# Altium schematic sheet LED_Wall [Microcontroller].SchDoc: MICROCONTROLLER
size Letter
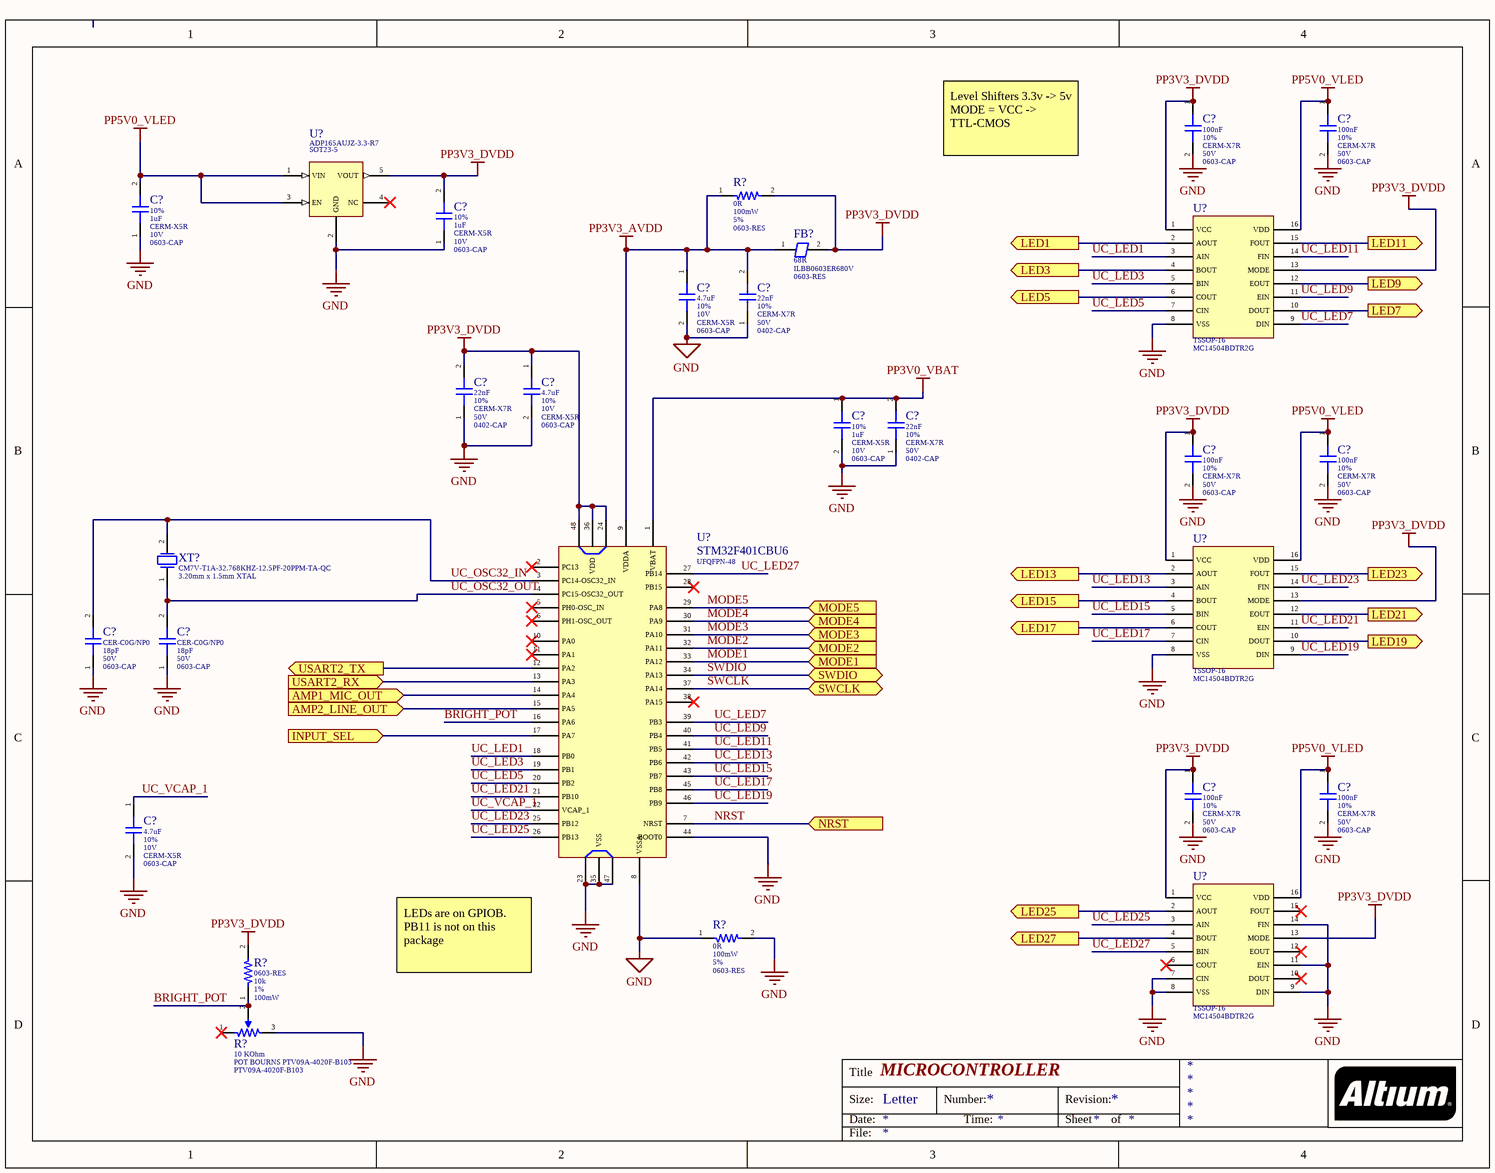
[diagram p0: LED_Wall [Microcontroller].SchDoc]

## Parts
(Parts that share a designator on the sheet are numbered #1, #2 ... from top to bottom, then left to right.)
C?#1  Capacitance: 100nF  Tolerance: 10%  Dielectric: CERM-X7R  Voltage: 50V  [0603-CAP]  (hidden comment: CAP TDK CGA3E2X7R1H104K080AA)
C?#2  Capacitance: 100nF  Tolerance: 10%  Dielectric: CERM-X7R  Voltage: 50V  [0603-CAP]  (hidden comment: CAP TDK CGA3E2X7R1H104K080AA)
C?#3  Tolerance: 10%  Capacitance: 1uF  Dielectric: CERM-X5R  Voltage: 10V  [0603-CAP]
C?#4  Tolerance: 10%  Capacitance: 1uF  Dielectric: CERM-X5R  Voltage: 10V  [0603-CAP]
C?#5  Capacitance: 4.7uF  Tolerance: 10%  Voltage Rating: 10V  Dielectric: CERM-X5R  [0603-CAP]  (hidden comment: CAP SAMSUNG CL10A475KP8NNNC)
C?#6  Capacitance: 22nF  Tolerance: 10%  Dielectric: CERM-X7R  Voltage: 50V  [0402-CAP]
C?#7  Capacitance: 22nF  Tolerance: 10%  Dielectric: CERM-X7R  Voltage: 50V  [0402-CAP]
C?#8  Capacitance: 4.7uF  Tolerance: 10%  Voltage Rating: 10V  Dielectric: CERM-X5R  [0603-CAP]  (hidden comment: CAP SAMSUNG CL10A475KP8NNNC)
C?#9  Tolerance: 10%  Capacitance: 1uF  Dielectric: CERM-X5R  Voltage: 10V  [0603-CAP]
C?#10  Capacitance: 22nF  Tolerance: 10%  Dielectric: CERM-X7R  Voltage: 50V  [0402-CAP]
C?#11  Capacitance: 100nF  Tolerance: 10%  Dielectric: CERM-X7R  Voltage: 50V  [0603-CAP]  (hidden comment: CAP TDK CGA3E2X7R1H104K080AA)
C?#12  Capacitance: 100nF  Tolerance: 10%  Dielectric: CERM-X7R  Voltage: 50V  [0603-CAP]  (hidden comment: CAP TDK CGA3E2X7R1H104K080AA)
C?#13  Dielectric: CER-C0G/NP0  Capacitance: 18pF  Voltage - Rated: 50V  [0603-CAP]
C?#14  Dielectric: CER-C0G/NP0  Capacitance: 18pF  Voltage - Rated: 50V  [0603-CAP]
C?#15  Capacitance: 100nF  Tolerance: 10%  Dielectric: CERM-X7R  Voltage: 50V  [0603-CAP]  (hidden comment: CAP TDK CGA3E2X7R1H104K080AA)
C?#16  Capacitance: 100nF  Tolerance: 10%  Dielectric: CERM-X7R  Voltage: 50V  [0603-CAP]  (hidden comment: CAP TDK CGA3E2X7R1H104K080AA)
C?#17  Capacitance: 4.7uF  Tolerance: 10%  Voltage Rating: 10V  Dielectric: CERM-X5R  [0603-CAP]  (hidden comment: CAP SAMSUNG CL10A475KP8NNNC)
FB?  Impedance: 68R  Manufacturer Part Number: ILBB0603ER680V  [0603-RES]  (hidden comment: FB VISHAY ILBB0603ER680V)
R?#1  Resistance: 0R  Power Rating: 100mW  Resistance Tolerance: 5%  [0603-RES]  (hidden comment: RES YAGEO RC0603JR-070RL)
R?#2  Resistance: 0R  Power Rating: 100mW  Resistance Tolerance: 5%  [0603-RES]  (hidden comment: RES YAGEO RC0603JR-070RL)
R?#3  Resistance: 10k  Tolerance: 1%  Power: 100mW  [0603-RES]  (hidden comment: RES BOURNS CR0603AFX-1002EAS)
R?#4  Resistance Value: 10 KOhm  Manufacturer Part Number: PTV09A-4020F-B103  [POT BOURNS PTV09A-4020F-B103]  (hidden comment: POT BOURNS PTV09A-4020F-B103)
U?#1  Manufacturer Part Number: ADP165AUJZ-3.3-R7  [SOT23-5]  (hidden comment: IC ANALOG DEVICES ADP165AUJZ-3.3-R7)
U?#2  Manufacturer Part Number: MC14504BDTR2G  [TSSOP-16]  (hidden comment: IC ON MC14504BDTR2G)
U?#3  Manufacturer Part Number: MC14504BDTR2G  [TSSOP-16]  (hidden comment: IC ON MC14504BDTR2G)
U?#4  Manufacturer Part Number: STM32F401CBU6  [UFQFPN-48]  (hidden comment: *)
U?#5  Manufacturer Part Number: MC14504BDTR2G  [TSSOP-16]  (hidden comment: IC ON MC14504BDTR2G)
XT?  Manufacturer Part Number: CM7V-T1A-32.768KHZ-12.5PF-20PPM-TA-QC  [3.20mm x 1.5mm XTAL]  (hidden comment: *)

## Ports
AMP1_MIC_OUT (in), AMP2_LINE_OUT (in), INPUT_SEL (in), LED1 (out), LED3 (out), LED5 (out), LED7 (out), LED9 (out), LED11 (out), LED13 (out), LED15 (out), LED17 (out), LED19 (out), LED21 (out), LED23 (out), LED25 (out), LED27 (out), MODE1 (in), MODE2 (in), MODE3 (in), MODE4 (in), MODE5 (in), NRST (in), SWCLK (bidir), SWDIO (bidir), USART2_RX (in), USART2_TX (out)

## Nets
GND: C?#1.2 C?#2.2 C?#3.1 C?#4.1 C?#5.2 C?#6.1 C?#7.1 C?#8.2 C?#9.2 C?#10.1 C?#11.2 C?#12.2 C?#13.1 C?#14.1 C?#15.2 C?#16.2 C?#17.2 R?#2.1 R?#2.2 R?#4.3 U?#1.2(GND) U?#2.8(VSS) U?#3.8(VSS) U?#4.8(VSSA) U?#4.23(VSS) U?#4.35(VSS) U?#4.44(BOOT0) U?#4.47(VSS) U?#5.7(CIN) U?#5.8(VSS) U?#5.9(DIN) U?#5.11(EIN) U?#5.14(FIN)
PP3V0_VBAT: C?#9.1 C?#10.2 U?#4.1(VBAT)
PP3V3_AVDD: C?#5.1 C?#6.2 FB?.1 R?#1.1 U?#4.9(VDDA)
PP3V3_DVDD: C?#1.1 C?#4.2 C?#7.2 C?#8.1 C?#11.1 C?#15.1 FB?.2 R?#1.2 R?#3.2 U?#1.5(VOUT) U?#2.1(VCC) U?#2.13(MODE) U?#3.1(VCC) U?#3.13(MODE) U?#4.24(VDD) U?#4.36(VDD) U?#4.48(VDD) U?#5.1(VCC) U?#5.13(MODE)
PP5V0_VLED: C?#2.1 C?#3.2 C?#12.1 C?#16.1 U?#1.1(VIN) U?#1.3(EN) U?#2.16(VDD) U?#3.16(VDD) U?#5.16(VDD)
AMP1_MIC_OUT: U?#4.14(PA4) ; port AMP1_MIC_OUT
AMP2_LINE_OUT: U?#4.15(PA5) ; port AMP2_LINE_OUT
BRIGHT_POT: R?#3.1 R?#4.2 U?#4.16(PA6)
INPUT_SEL: U?#4.17(PA7) ; port INPUT_SEL
LED1: U?#2.2(AOUT) ; port LED1
LED3: U?#2.4(BOUT) ; port LED3
LED5: U?#2.6(COUT) ; port LED5
LED7: U?#2.10(DOUT) ; port LED7
LED9: U?#2.12(EOUT) ; port LED9
LED11: U?#2.15(FOUT) ; port LED11
LED13: U?#3.2(AOUT) ; port LED13
LED15: U?#3.4(BOUT) ; port LED15
LED17: U?#3.6(COUT) ; port LED17
LED19: U?#3.10(DOUT) ; port LED19
LED21: U?#3.12(EOUT) ; port LED21
LED23: U?#3.15(FOUT) ; port LED23
LED25: U?#5.2(AOUT) ; port LED25
LED27: U?#5.4(BOUT) ; port LED27
MODE1: U?#4.33(PA12) ; port MODE1
MODE2: U?#4.32(PA11) ; port MODE2
MODE3: U?#4.31(PA10) ; port MODE3
MODE4: U?#4.30(PA9) ; port MODE4
MODE5: U?#4.29(PA8) ; port MODE5
NRST: U?#4.7(NRST) ; port NRST
SWCLK: U?#4.37(PA14) ; port SWCLK
SWDIO: U?#4.34(PA13) ; port SWDIO
UC_LED1: U?#2.3(AIN) U?#4.18(PB0)
UC_LED3: U?#2.5(BIN) U?#4.19(PB1)
UC_LED5: U?#2.7(CIN) U?#4.20(PB2)
UC_LED7: U?#2.9(DIN) U?#4.39(PB3)
UC_LED9: U?#2.11(EIN) U?#4.40(PB4)
UC_LED11: U?#2.14(FIN) U?#4.41(PB5)
UC_LED13: U?#3.3(AIN) U?#4.42(PB6)
UC_LED15: U?#3.5(BIN) U?#4.43(PB7)
UC_LED17: U?#3.7(CIN) U?#4.45(PB8)
UC_LED19: U?#3.9(DIN) U?#4.46(PB9)
UC_LED21: U?#3.11(EIN) U?#4.21(PB10)
UC_LED23: U?#3.14(FIN) U?#4.25(PB12)
UC_LED25: U?#4.26(PB13) U?#5.3(AIN)
UC_LED27: U?#4.27(PB14) U?#5.5(BIN)
UC_OSC32_IN: C?#13.2 U?#4.3(PC14-OSC32_IN) XT?.2
UC_OSC32_OUT: C?#14.2 U?#4.4(PC15-OSC32_OUT) XT?.1
UC_VCAP_1: C?#17.1 U?#4.22(VCAP_1)
USART2_RX: U?#4.13(PA3) ; port USART2_RX
USART2_TX: U?#4.12(PA2) ; port USART2_TX

Not connected (* = marked no-connect by the designer): R?#4 1*; U?#1 4(NC)*; U?#4 2(PC13)* 5(PH0-OSC_IN)* 6(PH1-OSC_OUT)* 10(PA0)* 11(PA1)* 28(PB15)* 38(PA15)*; U?#5 6(COUT)* 10(DOUT)* 12(EOUT)* 15(FOUT)*

## Notes on the sheet
- Level Shifters 3.3v -> 5v
  MODE = VCC -> TTL-CMOS
- (near U?#4) LEDs are on GPIOB.
  PB11 is not on this package
- Title
- Size:
- Date:
- Letter
- Number:
- Time:
- Revision:
- Sheet
- of
- File:

## Library data of the parts
C?#1 C?#2 C?#11 C?#12 C?#15 C?#16 = CAP TDK CGA3E2X7R1H104K080AA: CAP CER 0.1UF 50V X7R 0603; Supplier 1: Digi-Key; Manufacturer: TDK; Manufacturer Part Number: CGA3E2X7R1H104K080AA; Stock 1: 11391991; Pricing 1: 1=0.1, 10=0.075, 100=0.0335, 500=0.0239, 1000=0.0188 (USD); Mount: Surface Mount; Case/Package: 0603; Weight: 7.1E-05oz; Case Code (Imperial): 0603; Case Code (Metric): 1608; Min Operating Temperature: -55°C; Max Operating Temperature: 125°C; Voltage Rating (DC): 50V; Packaging: Tape and Reel; Package Quantity: 1; Voltage Rating: 50V; Termination: SMD/SMT; Composition: Ceramic; Length: 1.6mm; Height: 0.8mm; Width: 0.8mm; Thickness: 0.035inch; Depth: 0.8mm; Ratings: AEC-Q200; Radiation Hardening: No; REACH SVHC: No SVHC; Lead Free: Lead Free; ComponentLink1URL: http://www.farnell.com/datasheets/1796654.pdf?src-supplier=Mouser; ComponentLink1Description: http://www.farnell.com/datasheets/1796654.pdf?src-supplier=Mouser; ComponentLink2URL: http://product.tdk.com/capacitor/mlcc/en/documents/mlccspec_automotive_general_midvoltage_en.pdf?src-supplier=Future+Electronics; ComponentLink2Description: http://product.tdk.com/capacitor/mlcc/en/documents/mlccspec_automotive_general_midvoltage_en.pdf?src-supplier=Future+Electronics; ComponentLink3URL: http://www.farnell.com/datasheets/1735392.pdf?src-supplier=Element14; ComponentLink3Description: http://www.farnell.com/datasheets/1735392.pdf?src-supplier=Element14; ComponentLink4URL: https://www.verical.com/server-webapp/html/getDatasheet?partID=715867&src-supplier=Verical; ComponentLink4Description: https://www.verical.com/server-webapp/html/getDatasheet?partID=715867&src-supplier=Verical; ComponentLink5URL: http://www.farnell.com/datasheets/1796654.pdf?src-supplier=Newark; ComponentLink5Description: http://www.farnell.com/datasheets/1796654.pdf?src-supplier=Newark; Supplier Part Number 1: 445-5666-1-ND; CurrentFootprint: 0603-CAP
C?#3 C?#4 C?#9 = CAP SAMSUNG CL10A105KP8NNNC: CAP CER 1UF 10V X5R 0603; Supplier 1: Digi-Key; Manufacturer: Samsung; Manufacturer Part Number: CL10A105KP8NNNC; Stock 1: 4040315; Pricing 1: 1=0.1, 10=0.036, 100=0.0161, 500=0.0115, 1000=0.0091 (USD); Mount: Surface Mount; Case/Package: 0603; Case Code (Metric): 1608; Case Code (Imperial): 0603; Contact Plating: Tin; Min Operating Temperature: -55°C; Max Operating Temperature: 85°C; Packaging: Tape and Reel; Package Quantity: 1; Voltage Rating: 10V; Length: 1.6mm; Height: 0.8mm; Width: 0.031inch; Thickness: 0.035inch; Depth: 0.8mm; Radiation Hardening: No; ComponentLink1URL: https://www.verical.com/server-webapp/html/getDatasheet?partID=358616&src-supplier=Verical; ComponentLink1Description: https://www.verical.com/server-webapp/html/getDatasheet?partID=358616&src-supplier=Verical; ComponentLink2URL: http://www1.futureelectronics.com/doc/SAMSUNG%20PASSIVE/CL05B104KQ5NNNC.pdf?src-supplier=Future+Electronics; ComponentLink2Description: http://www1.futureelectronics.com/doc/SAMSUNG%20PASSIVE/CL05B104KQ5NNNC.pdf?src-supplier=Future+Electronics; Supplier Part Number 1: 1276-1182-1-ND; CurrentFootprint: 0603-CAP
C?#5 C?#8 C?#17 = CAP SAMSUNG CL10A475KP8NNNC: CAP CER 4.7UF 10V X5R 0603; Supplier 1: Digi-Key; Manufacturer: Samsung; Manufacturer Part Number: CL10A475KP8NNNC; Stock 1: 2594398; Pricing 1: 1=0.13, 10=0.096, 100=0.0452, 500=0.0317, 1000=0.0262 (USD); Mount: Surface Mount; Case/Package: 0603; Case Code (Metric): 1608; Case Code (Imperial): 0603; Contact Plating: Tin; Min Operating Temperature: -55°C; Max Operating Temperature: 85°C; Package Quantity: 1; Packaging: Tape and Reel; Length: 1.6mm; Height: 0.8mm; Width: 0.031inch; Thickness: 0.035inch; Depth: 0.8mm; Radiation Hardening: No; ComponentLink1URL: http://www.samsungsem.com/kr/support/library/product-catalog/mlcc.jsp?src-supplier=Digi-Key; ComponentLink1Description: http://www.samsungsem.com/kr/support/library/product-catalog/mlcc.jsp?src-supplier=Digi-Key; ComponentLink2URL: https://www.verical.com/server-webapp/html/getDatasheet?partID=358676&src-supplier=Verical; ComponentLink2Description: https://www.verical.com/server-webapp/html/getDatasheet?partID=358676&src-supplier=Verical; ComponentLink3URL: http://www1.futureelectronics.com/doc/SAMSUNG%20PASSIVE/CL05B104KQ5NNNC.pdf?src-supplier=Future+Electronics; ComponentLink3Description: http://www1.futureelectronics.com/doc/SAMSUNG%20PASSIVE/CL05B104KQ5NNNC.pdf?src-supplier=Future+Electronics; Supplier Part Number 1: 1276-1044-1-ND; CurrentFootprint: 0603-CAP
C?#6 C?#7 C?#10 = CAP MURATA GRM155R71H223KA12D: CAP CER 0.022UF 50V X7R 0402; Manufacturer: Murata; Material: Ceramic; Supplier 1: Digi-Key; Manufacturer Part Number: GRM155R71H223KA12D; Stock 1: 502642; Pricing 1: 1=0.1, 10=0.053, 100=0.0237, 500=0.0169, 1000=0.0133, 2500=0.0121, 5000=0.0111 (USD); Mount: Surface Mount; Case/Package: 0402; Number of Pins: 2; Case Code (Metric): 1005; Case Code (Imperial): 0402; Min Operating Temperature: -55°C; Max Operating Temperature: 125°C; Packaging: Tape and Reel; Package Quantity: 1; Voltage Rating: 50V; Voltage Rating (DC): 50V; Termination: SMD/SMT; Length: 1mm; Height: 0.5mm; Width: 0.02inch; Thickness: 0.022inch; Depth: 0.5mm; Radiation Hardening: No; REACH SVHC: No SVHC; Lead Free: Lead Free; ComponentLink1URL: https://www.verical.com/server-webapp/html/getDatasheet?partID=178940&src-supplier=Verical; ComponentLink1Description: https://www.verical.com/server-webapp/html/getDatasheet?partID=178940&src-supplier=Verical; ComponentLink2URL: https://www.murata.com/~/media/webrenewal/support/library/catalog/products/capacitor/mlcc/c02e.ashx?la=en-us&src-supplier=Digi-Key; ComponentLink2Description: https://www.murata.com/~/media/webrenewal/support/library/catalog/products/capacitor/mlcc/c02e.ashx?la=en-us&src-supplier=Digi-Key; ComponentLink3URL: http://www.farnell.com/datasheets/2048677.pdf?src-supplier=Element14; ComponentLink3Description: http://www.farnell.com/datasheets/2048677.pdf?src-supplier=Element14; ComponentLink4URL: http://search.murata.co.jp/Ceramy/image/img/w_hinm/L0005E.pdf?src-supplier=Future+Electronics; ComponentLink4Description: http://search.murata.co.jp/Ceramy/image/img/w_hinm/L0005E.pdf?src-supplier=Future+Electronics; ComponentLink5URL: https://produktinfo.conrad.com/datenblaetter/450000-474999/454297-da-01-en-VS_KONDENSATOR_0402.pdf?src-supplier=Conrad; ComponentLink5Description: https://produktinfo.conrad.com/datenblaetter/450000-474999/454297-da-01-en-VS_KONDENSATOR_0402.pdf?src-supplier=Conrad; Supplier Part Number 1: 490-3884-1-ND; CurrentFootprint: 0402-CAP
C?#13 C?#14 = CAP YAGEO CC0603JRNPO9BN180: CAP CER 18PF 50V C0G/NPO 0603; Manufacturer: Yageo; Product Training Modules: Multilayer Ceramic Capacitors; Featured Product: Commodity Multilayer Ceramic Capacitors – CC Series; Temperature Coefficient: C0G, NP0; Online Catalog: CC Series; Other Names: 311-1061-6 311-1279-6 311-1279-6-ND; Tolerance: ±5%; Supplier 1: Digi-Key; Supplier Part Number 1: 311-1061-1-ND; Stock 1: 146690; Pricing 1: 1=0.1, 10=0.047, 100=0.0208, 500=0.0149, 1000=0.0117 (USD); Standard Package: 1; Category: Capacitors; Family: Ceramic Capacitors; Series: CC; Packaging: Digi-Reel®; Mounting Type: Surface Mount, MLCC; Operating Temperature: -55°C ~ 125°C; Applications: General Purpose; Ratings: -; Package / Case: 0603 (1608 Metric); Size / Dimension: 0.063" L x 0.031" W (1.60mm x 0.80mm); Height - Seated (Max): -; Thickness (Max): 0.035" (0.90mm); Lead Spacing: -; Features: -; Lead Style: -; ComponentLink1URL: http://www.farnell.com/datasheets/1734582.pdf?src-supplier=Element14; ComponentLink1Description: http://www.farnell.com/datasheets/1734582.pdf?src-supplier=Element14; ComponentLink2URL: http://www.farnell.com/datasheets/2213336.pdf?src-supplier=Element14; ComponentLink2Description: http://www.farnell.com/datasheets/2213336.pdf?src-supplier=Element14; ComponentLink3URL: http://www.yageo.com/documents/recent/UPY-GP_NP0_16V-to-50V_8.pdf?src-supplier=Avnet; ComponentLink3Description: http://www.yageo.com/documents/recent/UPY-GP_NP0_16V-to-50V_8.pdf?src-supplier=Avnet; ComponentLink4URL: http://www.yageo.com/documents/recent/UPY-GP_NP0_16V-to-50V_16.pdf?src-supplier=Digi-Key; ComponentLink4Description: http://www.yageo.com/documents/recent/UPY-GP_NP0_16V-to-50V_16.pdf?src-supplier=Digi-Key; ComponentLink5URL: http://www.yageo.com/documents/recent/UPY-GP_NP0_16V-to-50V_8.pdf?src-supplier=Avnet+Europe; ComponentLink5Description: http://www.yageo.com/documents/recent/UPY-GP_NP0_16V-to-50V_8.pdf?src-supplier=Avnet+Europe; ComponentLink6URL: http://www.farnell.com/datasheets/1443161.pdf?src-supplier=Element14; ComponentLink6Description: http://www.farnell.com/datasheets/1443161.pdf?src-supplier=Element14; ComponentLink7URL: http://www.mouser.com/ds/2/447/Yageo_UPY-GP_NP0_16V-to-50V_9-358835.pdf?src-supplier=Mouser; ComponentLink7Description: http://www.mouser.com/ds/2/447/Yageo_UPY-GP_NP0_16V-to-50V_9-358835.pdf?src-supplier=Mouser; Manufacturer Part Number: CC0603JRNPO9BN180; CurrentFOotprint: 0603-CAP
FB? = FB VISHAY ILBB0603ER680V: FERRITE BEAD 68 OHM 0603 1LN; Current Rating: 200mA; Tolerance: 25%; Number of Lines: 1; DC Resistance (DCR): 100mR; Test Frequency: 100MHz; Inductance: 68uH; Supplier 1: Digi-Key; Manufacturer: Vishay; Stock 1: 4606; Pricing 1: 1=0.1, 10=0.073, 25=0.066, 50=0.0594, 100=0.0436, 250=0.0317, 500=0.029, 1000=0.0251 (USD); Mount: Surface Mount; Case/Package: 0603; Number of Pins: 2; Weight: 7.1E-05oz; Core Material: Ferrite; Case Code (Metric): 1608; Case Code (Imperial): 0603; Min Operating Temperature: -55°C; Max Operating Temperature: 125°C; Packaging: Tape and Reel; Package Quantity: 4000; Max Current Rating: 200mA; Termination: SMD/SMT; Max DC Current: 200mA; Length: 0.063inch; Height: 0.037inch; Width: 0.031inch; Depth: 0.95mm; Lead Free: Lead Free; ComponentLink1URL: http://components.arrow.com/part/dataview/41529776S9710326N6892?src-supplier=Arrow; ComponentLink1Description: http://components.arrow.com/part/dataview/41529776S9710326N6892?src-supplier=Arrow; ComponentLink2URL: http://www.vishay.com/docs/34024/ilbb0603.pdf?src-supplier=Digi-Key; ComponentLink2Description: http://www.vishay.com/docs/34024/ilbb0603.pdf?src-supplier=Digi-Key; Supplier Part Number 1: 541-2605-1-ND; Current Footprint: 0603-RES
R?#1 R?#2 = RES YAGEO RC0603JR-070RL: RES SMD 0 OHM JUMPER 1/10W 0603; Voltage Rating: 50V; Resistor Case Style: 0603 [1608 Metric]; Product Range: RC Series; Resistor Element Type: Thick Film; Temperature Coefficient: ± 200ppm/°C; SVHC: To Be Advised; Supplier 1: Digi-Key; Supplier Part Number 1: 311-0.0GRDKR-ND; Manufacturer: Yageo; Stock 1: 20967340; Pricing 1: 1=0.1, 10=0.019, 25=0.0136, 50=0.0104, 100=0.0077, 250=0.0059, 500=0.0047, 1000=0.0035 (USD); Packaging: Cut Tape; Automotive Qualification Standard: -; MSL: MSL 1 - Unlimited; ComponentLink1URL: http://www.farnell.com/datasheets/2167052.pdf?src-supplier=Element14; ComponentLink1Description: http://www.farnell.com/datasheets/2167052.pdf?src-supplier=Element14; ComponentLink2URL: https://www.verical.com/server-webapp/html/getDatasheet?partID=329462&src-supplier=Verical; ComponentLink2Description: https://www.verical.com/server-webapp/html/getDatasheet?partID=329462&src-supplier=Verical; ComponentLink3URL: http://www.yageo.com/documents/recent/PYu-RC_Group_51_RoHS_L_9.pdf?src-supplier=Mouser; ComponentLink3Description: http://www.yageo.com/documents/recent/PYu-RC_Group_51_RoHS_L_9.pdf?src-supplier=Mouser; ComponentLink4URL: http://www.farnell.com/datasheets/443971.pdf?src-supplier=Element14; ComponentLink4Description: http://www.farnell.com/datasheets/443971.pdf?src-supplier=Element14; ComponentLink5URL: http://documents.rs-components.com/techlib://itc_doclist_GB.htm?stockno=6515918&src-supplier=RSComponents; ComponentLink5Description: http://documents.rs-components.com/techlib://itc_doclist_GB.htm?stockno=6515918&src-supplier=RSComponents; Manufacturer Part Number: RC0603JR-070RL; CurrentFootprint: 0603-RES
R?#3 = RES BOURNS CR0603AFX-1002EAS: RESA-AS 0603 10K 1% 100MW TC100; Supplier 1: Digi-Key; Manufacturer: Bourns; Manufacturer Part Number: CR0603AFX-1002EAS; Stock 1: 4756; Pricing 1: 1=0.1, 10=0.075, 100=0.0307, 1000=0.0138, 2500=0.012 (USD); Supplier Part Number 1: CR0603AFX-1002EASCT-ND; Current Footprint: 0603-RES
R?#4 = POT BOURNS PTV09A-4020F-B103: POT 10K OHM 1/20W CARBON LINEAR; Number of Turns: 1(Elec)|1(Mech) Turns; Rad Hard: No; Shaft Diameter: 6 mm; Supplier 1: Digi-Key; Supplier Part Number 1: PTV09A-4020F-B103-ND; Manufacturer: Bourns; Stock 1: 626; Pricing 1: 1=0.83, 10=0.744, 25=0.672, 50=0.648, 100=0.612, 250=0.588, 500=0.552, 1000=0.456, 5000=0.372 (USD); Packaging: Bulk; Type: Potentiometer; Mounting: Bracket Mount/Through Hole; Technology: Carbon Film; Operating Temperature: -10 to 50 °C; ComponentLink1URL: https://www.bourns.com/docs/Product-Datasheets/PTV09.pdf?src-supplier=Digi-Key; ComponentLink1Description: https://www.bourns.com/docs/Product-Datasheets/PTV09.pdf?src-supplier=Digi-Key; ComponentLink2URL: http://uk.rs-online.com/webdocs/0fa5/0900766b80fa58ec.pdf?src-supplier=RSComponents; ComponentLink2Description: http://uk.rs-online.com/webdocs/0fa5/0900766b80fa58ec.pdf?src-supplier=RSComponents; Current Footprint: POT BOURNS PTV09A-4020F-B103
U?#1 = IC ANALOG DEVICES ADP165AUJZ-3.3-R7: IC REG LIN POS ADJ 150MA TSOT23; Output Voltage: 3.3V; Dropout Voltage: 120mV; Number of Regulators: 1; Min Current Limit: 215mA; Polarity: Positive; Quiescent Current: 590nA; Max Input Voltage: 5.5V; Min Input Voltage: 2.2V; Accuracy: 1%; Output Type: Fixed; Supplier 1: Digi-Key; Manufacturer: Analog Devices; Stock 1: 2434; Pricing 1: 1=1.16, 10=1.033, 25=0.98, 100=0.805, 250=0.7525, 500=0.665, 1000=0.525 (USD); Mount: Surface Mount; Case/Package: SOT-23-5; Number of Pins: 5; Contact Plating: Gold; Min Operating Temperature: -40°C; Max Operating Temperature: 125°C; Packaging: Tape and Reel; Output Current: 150mA; Number of Outputs: 1; Max Output Current: 150mA; Lead Free: Contains Lead; ComponentLink1URL: http://www.analog.com/media/en/technical-documentation/data-sheets/ADP165_166.pdf?src-supplier=Digi-Key; ComponentLink1Description: http://www.analog.com/media/en/technical-documentation/data-sheets/ADP165_166.pdf?src-supplier=Digi-Key; ComponentLink2URL: http://www.analog.com/static/imported-files/data_sheets/ADP165_166.pdf?src-supplier=Avnet; ComponentLink2Description: http://www.analog.com/static/imported-files/data_sheets/ADP165_166.pdf?src-supplier=Avnet; ComponentLink3URL: https://www.analog.com/media/en/technical-documentation/data-sheets/ADP165_166.pdf?src-supplier=Digi-Key; ComponentLink3Description: https://www.analog.com/media/en/technical-documentation/data-sheets/ADP165_166.pdf?src-supplier=Digi-Key; Supplier Part Number 1: ADP165AUJZ-3.3-R7CT-ND; CurrentFootprint: SOT23-5
U?#2 U?#3 U?#5 = IC ON MC14504BDTR2G: IC TRNSLTR UNIDIR 16TSSOP; Manufacturer: ON Semiconductor; Translator Type: Voltage Level; Channel Type: Unidirectional; Number of Circuits: 1; Channels per Circuit: 6; Voltage - VCCA: 3 V ~ 18 V; Output Type: Non-Inverted; Supplier 1: Digi-Key; Supplier Part Number 1: MC14504BDTR2GOSCT-ND; Stock 1: 11285; Pricing 1: 1=1.24, 10=1.107, 25=1.0512, 100=0.8634, 250=0.8071, 500=0.7133, 1000=0.5631 (USD); Category: Integrated Circuits (ICs); Family: Logic - Translators, Level Shifters; Series: -; Packaging: Digi-Reel®; Voltage - VCCB: 3 V ~ 18 V; Input Signal: -; Output Signal: -; Data Rate: -; Operating Temperature: -55°C ~ 125°C (TA); Features: -; Mounting Type: Surface Mount; Package / Case: 16-TSSOP (0.173", 4.40mm Width); Supplier Device Package: 16-TSSOP; ComponentLink1URL: http://www.onsemi.com/pub/Collateral/MC14504B-D.PDF?src-supplier=Avnet; ComponentLink1Description: http://www.onsemi.com/pub/Collateral/MC14504B-D.PDF?src-supplier=Avnet; ComponentLink2URL: http://www.onsemi.com/pub_link/Collateral/MC14504B-D.PDF?src-supplier=Future+Electronics; ComponentLink2Description: http://www.onsemi.com/pub_link/Collateral/MC14504B-D.PDF?src-supplier=Future+Electronics; ComponentLink3URL: http://www.onsemi.com/pub_link/Collateral/MC14504B-D.PDF?src-supplier=Digi-Key; ComponentLink3Description: http://www.onsemi.com/pub_link/Collateral/MC14504B-D.PDF?src-supplier=Digi-Key; ComponentLink4URL: http://www.onsemi.com/pub/Collateral/MC14504B-D.PDF?src-supplier=Digi-Key; ComponentLink4Description: http://www.onsemi.com/pub/Collateral/MC14504B-D.PDF?src-supplier=Digi-Key; ComponentLink5URL: http://www.onsemi.com/pub/Collateral/MC14504B-D.PDF?src-supplier=Avnet+Europe; ComponentLink5Description: http://www.onsemi.com/pub/Collateral/MC14504B-D.PDF?src-supplier=Avnet+Europe; CurrentFootprint: TSSOP-16
U?#4 = IC ST STM32F401CBU6: IC MCU 32BIT 128KB FLASH 48QFPN; Manufacturer: STMicroelectronics; Interface: I2C,SPI,USB,IrDA,SDIO,UART,USART,LIN,I2S; Max Supply Voltage: 3.6V; Min Supply Voltage: 1.8V; Operating Supply Voltage: 3.3V; Frequency: 84MHz; RAM Size: 64KB; Max Power Dissipation: 625mW; Number of I/Os: 36; Number of Timers/Counters: 8; Oscillator Type: Internal; Data Bus Width: 32b; Number of USB Channels: 1; Number of SPI Channels: 7; Number of PWM Channels: 4; Number of I2C Channels: 3; Watchdog Timer: Yes; Peripherals: Brown-out Detect/Reset,POR,PWM,WDT,DMA; Core Architecture: ARM; Supplier 1: Digi-Key; Stock 1: 403; Pricing 1: 1=3.99, 10=3.581, 25=3.386, 100=2.9344, 250=2.7839, 500=2.498, 1000=2.1067, 2500=2.0014, 5000=1.9261 (USD); Case/Package: UFQFPN; Number of Pins: 48; Contact Plating: Tin,Matte; Min Operating Temperature: -40°C; Max Operating Temperature: 85°C; Packaging: Tray; Memory Type: FLASH; Package Quantity: 1560; Max Frequency: 84MHz; Number of Programmable I/O: 36; Memory Size: 128KB; Length: 7.1mm; Height: 0.55mm; Width: 7.1mm; Radiation Hardening: No; Lead Free: Lead Free; REACH SVHC: No SVHC; ComponentLink1URL: http://www.st.com/st-web-ui/static/active/en/resource/technical/document/datasheet/DM00086815.pdf?src-supplier=Avnet; ComponentLink1Description: http://www.st.com/st-web-ui/static/active/en/resource/technical/document/datasheet/DM00086815.pdf?src-supplier=Avnet; Supplier Part Number 1: 497-17425-ND; Current Footprint: UFQFPN-48
XT? = XTAL MICRO CM7V-T1A-32.768KHZ-12.5PF-20PPM-TA-QC: CRYSTAL 32.768KHZ 12.5PF SMD; Manufacturer: Micro Crystal; Supplier 1: Digi-Key; Stock 1: 80; Pricing 1: 1=0.41, 10=0.341, 50=0.307, 100=0.2728, 500=0.2592 (USD); Supplier Part Number 1: 2195-CM7V-T1A-32.768KHZ-12.5PF-20PPM-TA-QCCT-ND; CurrentFootprint: 3.20mm x 1.5mm XTAL